# EAGLE design Metal Detctor V1 (EAGLE 6.5.0)
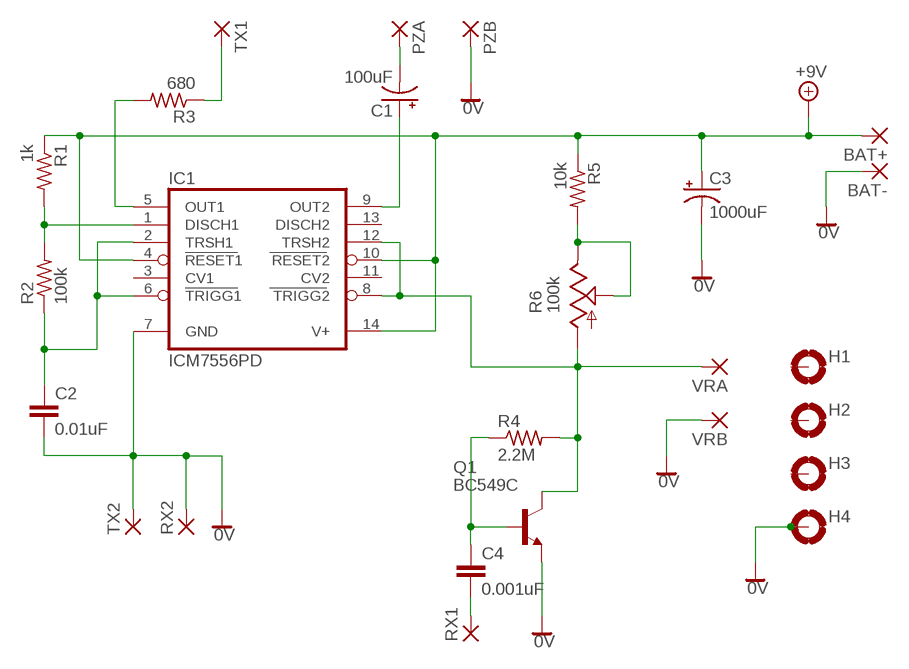
[diagram p0: schematic, sheet 1]

## Parts
BAT+  WIREPAD2,54/1,1  [2,54/1,1]
BAT-  WIREPAD2,54/1,1  [2,54/1,1]
C1  100uF  CPOL-USE5-8.5  [E5-8,5]
C2  0.01uF  C-EU050-024X044  [C050-024X044]
C3  1000uF  CPOL-USE5-10.5  [E5-10,5]
C4  0.001uF  C-EU050-024X044  [C050-024X044]
H1  MOUNT-PAD-ROUND3.0  [3,0-PAD]
H2  MOUNT-PAD-ROUND3.0  [3,0-PAD]
H3  MOUNT-PAD-ROUND3.0  [3,0-PAD]
H4  MOUNT-PAD-ROUND3.0  [3,0-PAD]
IC1  ICM7556PD  [DIL14]
PZA  WIREPAD2,54/1,1  [2,54/1,1]
PZB  WIREPAD2,54/1,1  [2,54/1,1]
Q1  BC549C  [TO92-EBC]
R1  1k  R-US_0207/12  [0207/12]
R2  100k  R-US_0207/12  [0207/12]
R3  680  R-US_0207/12  [0207/12]
R4  2.2M  R-US_0207/12  [0207/12]
R5  10k  R-US_0207/12  [0207/12]
R6  100k  TRIM_US-B90P  [SP19L]
RX1  WIREPAD2,54/1,1  [2,54/1,1]
RX2  WIREPAD2,54/1,1  [2,54/1,1]
TX1  WIREPAD2,54/1,1  [2,54/1,1]
TX2  WIREPAD2,54/1,1  [2,54/1,1]
VRA  WIREPAD2,54/1,1  [2,54/1,1]
VRB  WIREPAD2,54/1,1  [2,54/1,1]

## Nets
0V: BAT-.1(P) C2.2 C3.- H4.B3,0(MOUNT) IC1.7(GND) PZB.1(P) Q1.E RX2.1(P) TX2.1(P) VRB.1(P)
+9V: BAT+.1(P) C3.+ IC1.4(RESET1) IC1.10(RESET2) IC1.14(V+) R1.1 R5.1
N$1: IC1.1(DISCH1) R1.2 R2.2
N$2: C2.1 IC1.2(TRSH1) IC1.6(TRIGG1) R2.1
N$3: C1.+ IC1.9(OUT2)
N$5: IC1.5(OUT1) R3.2
N$6: R3.1 TX1.1(P)
N$7: IC1.8(TRIGG2) IC1.12(TRSH2) Q1.C R4.2 R6.A VRA.1(P)
N$8: C4.1 Q1.B R4.1
N$9: R5.2 R6.E R6.S
N$10: C1.- PZA.1(P)
N$11: C4.2 RX1.1(P)
Unconnected: H1.B3,0(MOUNT) H2.B3,0(MOUNT) H3.B3,0(MOUNT) IC1.3(CV1) IC1.11(CV2) IC1.13(DISCH2)

## Library data of the parts
BAT+ BAT- PZA PZB RX1 RX2 TX1 TX2 VRA VRB = wirepad:WIREPAD: Wire PAD connect wire on PCB
C1 C3 = rcl:CPOL-US: POLARIZED CAPACITOR, American symbol
C2 C4 = rcl:C-EU: CAPACITOR, European symbol
H1-H4 = holes:MOUNT-PAD-ROUND: MOUNTING PAD, round
IC1 = maxim:ICM7556PD: TIMER; OC_FARNELL: unknown; OC_NEWARK: unknown
Q1 = transistor-npn:BC549*: NPN Transistor
R1-R5 = adafruit:R-US_: RESISTOR, American symbol
R6 = pot:TRIM_US-: POTENTIOMETER

## Net classes
0 default: width 0.61 mm, drill 0.508 mm, clearance 0.254 mm

## Board
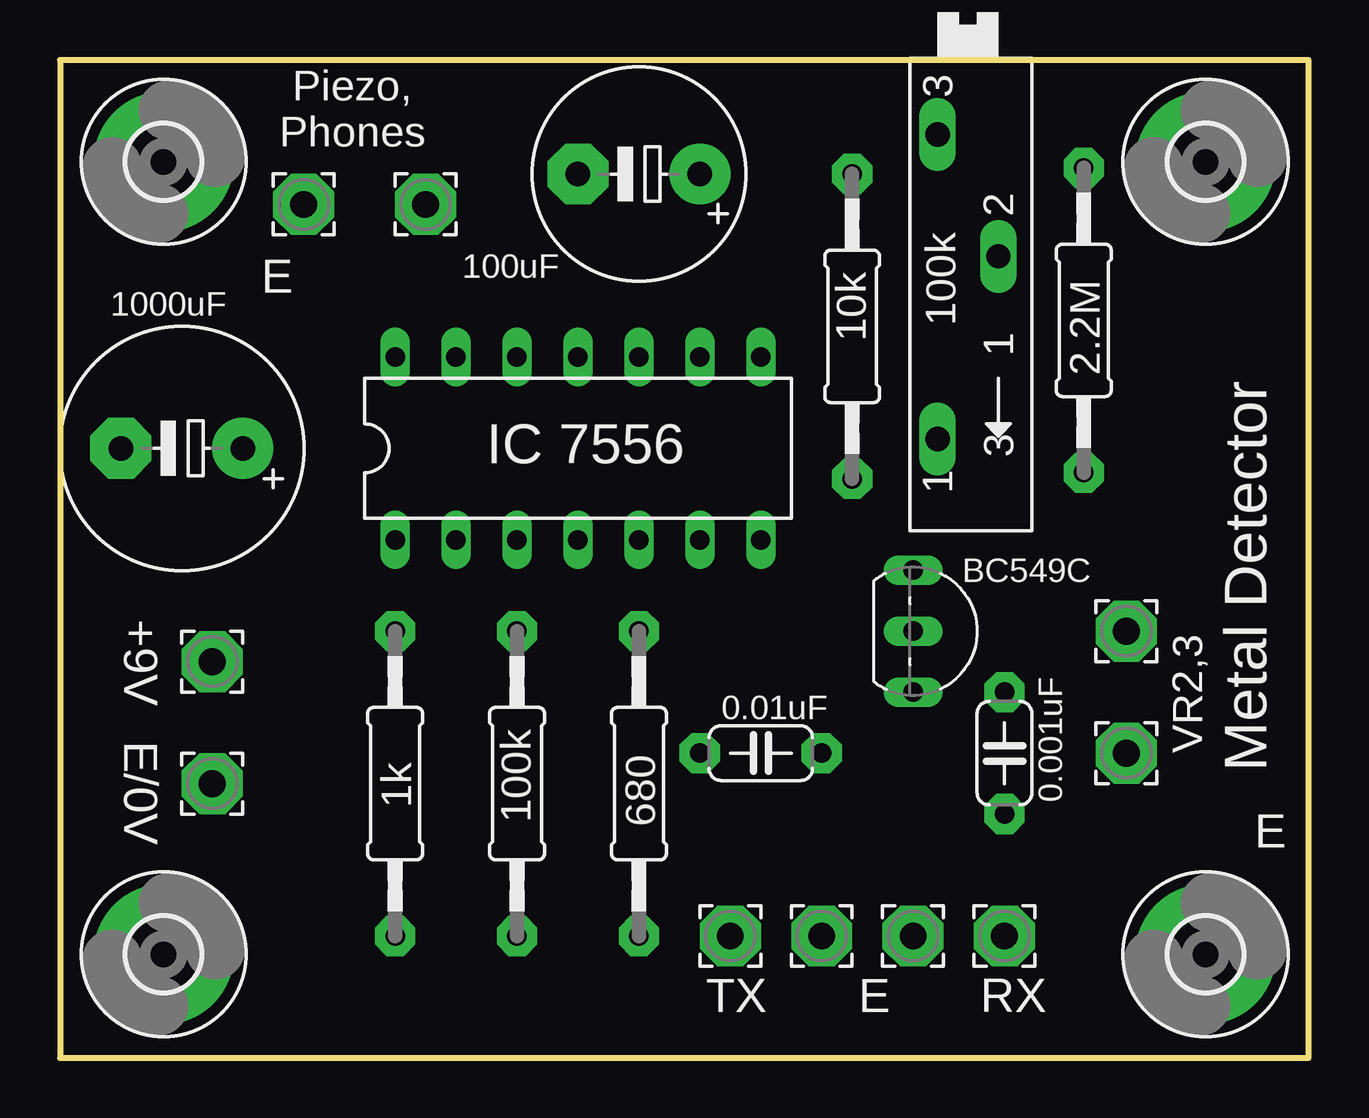
[diagram p1: board, top side]
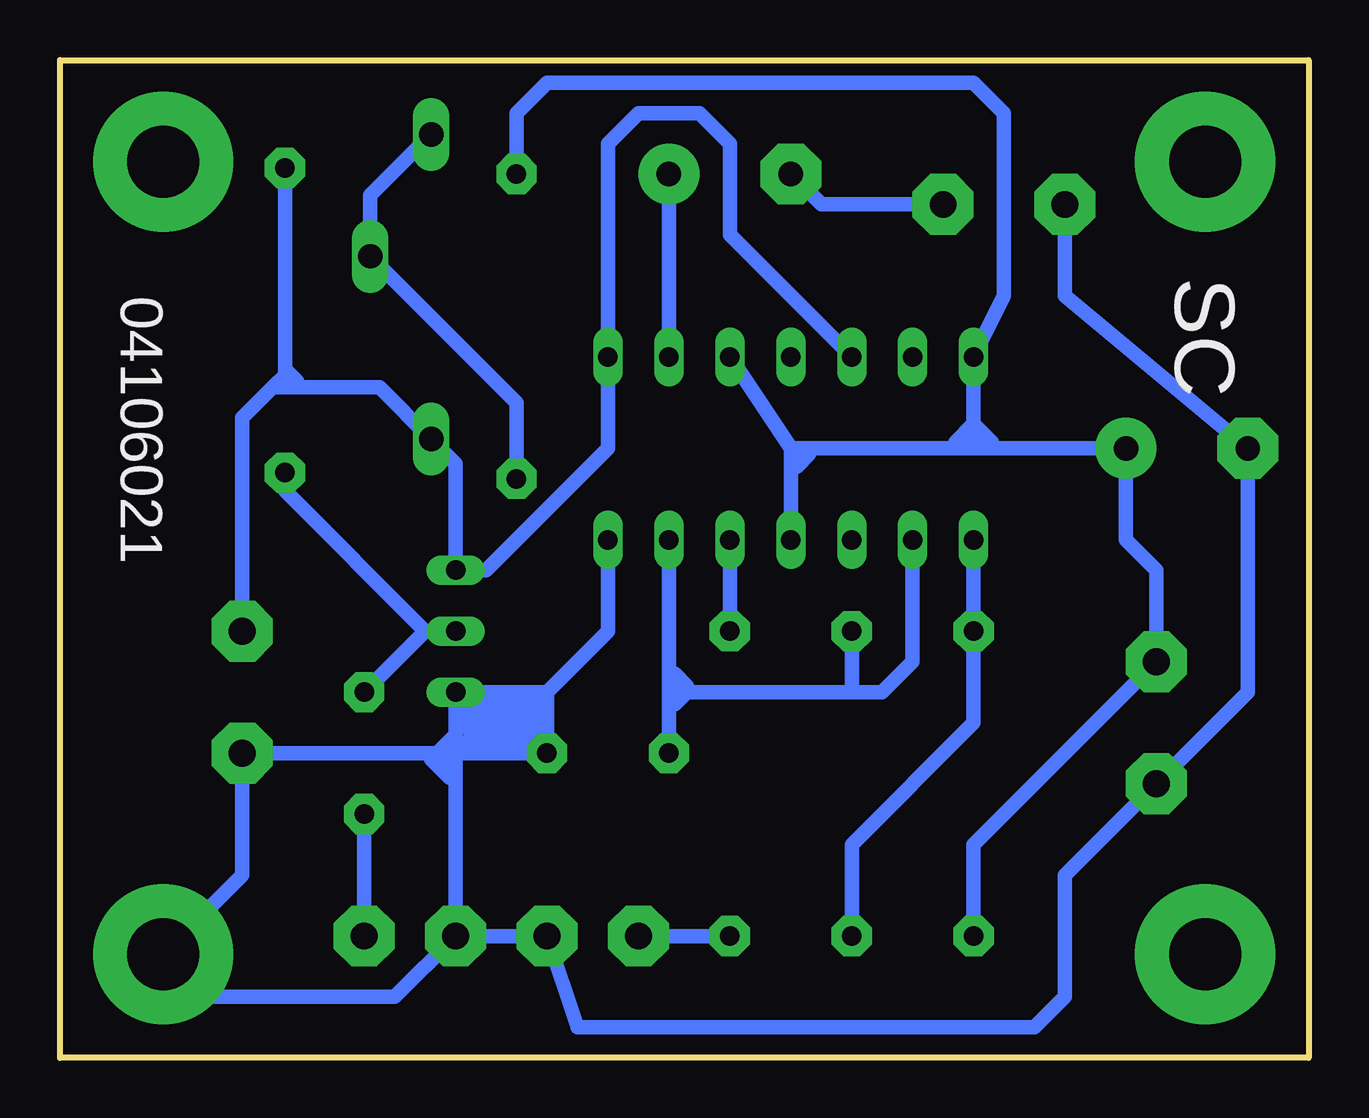
[diagram p2: board, bottom side, seen from below]

Size 52.05 x 41.58 mm. Coordinates in mm from the lower left corner, seen from the top.
Outline: 0,0 52.05,0 52.05,41.58 0,41.58 0,0
Copper layers (1*16): Top 0.0356mm / dielectric 1.5011mm / Bottom 0.0356mm
Design rules "OSH_Park": minimum track width 6mil, minimum drill 13mil, track to track 6mil, track to pad 6mil, pad to pad 6mil, via to via 6mil, smd to smd 6mil, copper to edge 15mil, drill to drill 6mil, minimum pad ring 7mil, minimum via ring 7mil, stop-mask expansion 4mil, vias tented up to drill 0mil, thermal gap 10mil

### Footprints (pad centres in the part's own frame; a part is rotated, then mirrored left to right if it is on the bottom)
2,54/1,1 = drill 1.118 pad 2.54 octagon: 1 0,0
E5-8,5 = drill 1.016 pad 2.54: + -2.54,0 | drill 1.016 pad 2.54 octagon: - 2.54,0
C050-024X044 = drill 0.813 pad 1.676 octagon: 1 -2.54,0; 2 2.54,0
E5-10,5 = drill 1.016 pad 2.54: + -2.54,0 | drill 1.016 pad 2.54 octagon: - 2.54,0
3,0-PAD = drill 3 pad 5.842: B3,0 0,0
DIL14 = drill 0.813 long: 1 -7.62,-3.81; 2 -5.08,-3.81; 3 -2.54,-3.81; 4 0,-3.81; 5 2.54,-3.81; 6 5.08,-3.81; 7 7.62,-3.81; 8 7.62,3.81; 9 5.08,3.81; 10 2.54,3.81; 11 0,3.81; 12 -2.54,3.81; 13 -5.08,3.81; 14 -7.62,3.81
TO92-EBC = drill 0.813 long: B 0,-1.27; C -2.54,-1.27; E 2.54,-1.27
0207/12 = drill 0.813 pad 1.676 octagon: 1 -6.35,0; 2 6.35,0
SP19L = drill 1.016 long: A 5.715,-1.27; E -6.985,-1.27; S -1.905,1.27

### Placement (x,y rotation side)
BAT+  6.35,16.51 0 top
BAT-  6.35,11.43 0 top
C1  24.13,36.83 180 top
C2  29.21,12.7 0 top
C3  5.08,25.4 180 top
C4  39.37,12.7 270 top
H1  4.32,4.32 0 top
H2  4.32,37.34 0 top
H3  47.75,37.34 0 top
H4  47.75,4.32 0 top
IC1  21.59,25.4 0 top
PZA  15.24,35.56 0 top
PZB  10.16,35.56 0 top
Q1  36.83,17.78 270 top
R1  13.97,11.43 90 top
R2  19.05,11.43 270 top
R3  24.13,11.43 90 top
R4  42.67,30.73 90 top
R5  33.02,30.48 270 top
R6  37.85,31.5 270 top
RX1  39.37,5.08 0 top
RX2  35.56,5.08 0 top
TX1  27.94,5.08 0 top
TX2  31.75,5.08 0 top
VRA  44.45,17.78 0 top
VRB  44.45,12.7 0 top

### Tracks (layer width: path | path; a pad name or v marks a point on that pad's centre or on a via)
0V
  Bottom 0.61: RX2.1 TX2.1 30.48,1.27 11.43,1.27 10.16,2.54 10.16,7.62 BAT-.1 2.54,15.24 C3.- 10.16,31.75 PZB.1 | 36.32,12.7 VRB.1 44.45,7.62 H4.B3,0 45.97,2.54 38.1,2.54 RX2.1 | 36.32,12.7 35.56,12.7 | 35.56,12.7 C2.2 31.75,15.24 | 35.56,12.7 35.56,13.46 | 35.56,13.46 Q1.E 31.75,15.24 | 31.75,15.24 29.21,17.78 IC1.7 | RX2.1 35.56,12.7 | 35.56,13.46 36.32,12.7
+9V
  Bottom 0.61: R1.1 13.97,8.89 BAT+.1 6.35,20.32 7.62,21.59 C3.+ 13.97,25.4 | 13.97,25.4 13.97,26.42 | 13.97,26.42 IC1.14 12.7,31.75 12.7,39.37 13.97,40.64 31.75,40.64 33.02,39.37 R5.1 | IC1.4 21.59,25.4 | 21.59,25.4 13.97,25.4 | IC1.10 21.59,25.4 | 13.97,26.42 13.21,25.65 | 13.97,26.42 14.73,25.65
N$1
  Bottom 0.61: R2.2 19.05,8.89 13.97,13.97 R1.2 IC1.1
N$2
  Bottom 0.61: C2.1 26.67,15.24 | 26.67,15.24 IC1.6 | IC1.2 16.51,16.51 17.78,15.24 19.05,15.24 | 19.05,15.24 25.91,15.24 | 25.91,15.24 26.67,15.24 | R2.1 19.05,15.24 | 25.91,15.24 26.42,14.73
N$3
  Bottom 0.61: C1.+ IC1.9
N$4
  Bottom 0.61: 26.42,16 25.91,15.49
N$5
  Bottom 0.61: R3.2 IC1.5
N$6
  Bottom 0.61: TX1.1 R3.1
N$7
  Bottom 0.61: IC1.12 24.13,34.29 24.13,38.1 25.4,39.37 27.94,39.37 29.21,38.1 IC1.8 29.21,25.4 34.29,20.32 Q1.C 35.56,24.77 R6.A 38.73,27.94 43.18,27.94 | VRA.1 44.45,26.67 43.18,27.94 | R4.2 42.67,28.7 | 42.67,28.7 42.67,28.45 43.18,27.94 | 42.67,28.7 42.16,28.19
N$8
  Bottom 0.61: C4.1 36.83,17.78 | 36.83,17.78 Q1.B | R4.1 42.67,23.62 36.83,17.78
N$9
  Bottom 0.61: R5.2 33.02,27.3 R6.S 39.12,35.94 R6.E
N$10
  Bottom 0.61: PZA.1 20.32,35.56 C1.-
N$11
  Bottom 0.61: C4.2 RX1.1
N$12
  Bottom 0.61: 32,14.73 35.31,14.73
N$13
  Bottom 0.61: 32,14.22 35.31,14.22
N$14
  Bottom 0.61: 32,13.72 35.05,13.72
N$15
  Bottom 0.61: 32.26,13.21 35.05,13.21
N$16
  Bottom 0.61: 36.58,12.45 35.81,11.68 35.81,12.19 36.07,12.45
N$17
  Bottom 0.61: 20.83,25.15 21.34,24.64

### Text on the board
tPlace: Piezo, / Phones | E | IC 7556 | +9V | E/0V | VR2,3 | Metal Detector | E | TX | E | RX
bPlace: SC | 04106021